# EAGLE design USB Isolator v001 (EAGLE 6.5.0)
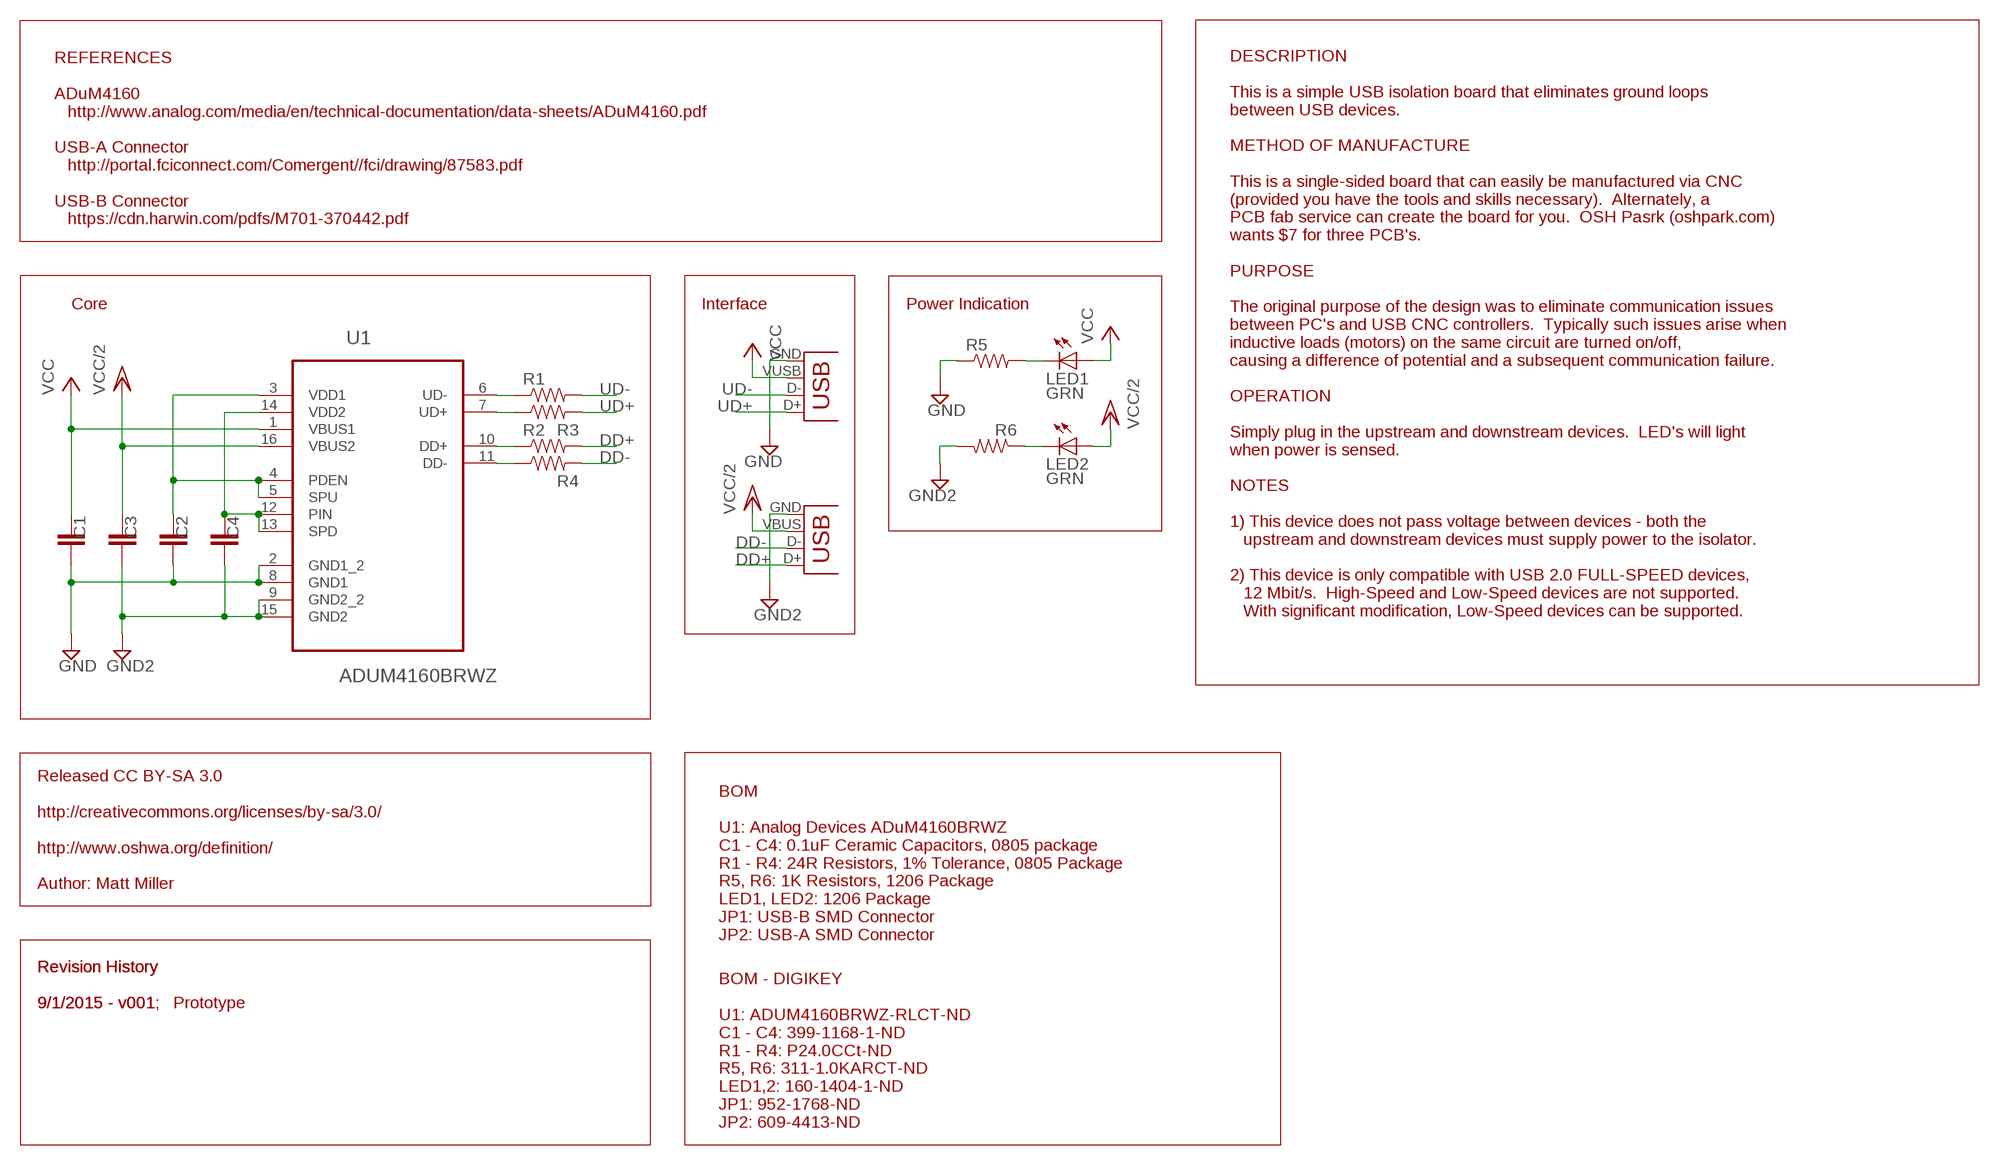
[diagram p0: schematic, sheet 1]

## Parts
C1  0.1uF  CAP0805  [0805]
C2  0.1uF  CAP0805  [0805]
C3  0.1uF  CAP0805  [0805]
C4  0.1uF  CAP0805  [0805]
JP1  USB-B-S  [USB-B-SMT]
JP2  USB-A-S  [USB-A-S]
LED1  GRN  LED1206  [LED-1206]
LED2  GRN  LED1206  [LED-1206]
R1  25  RESISTOR0805-RES  [0805]
R2  25  RESISTOR0805-RES  [0805]
R3  25  RESISTOR0805-RES  [0805]
R4  25  RESISTOR0805-RES  [0805]
R5  1K  RESISTOR1206  [1206]
R6  1K  RESISTOR1206  [1206]
U1  ADUM4160BRWZ  [SOIC127P1032X265-16N]

## Nets
DD+: JP2.D+ R4.2
DD-: JP2.D- R3.2
GND: C1.2 C2.2 JP1.GND R5.1 U1.2(GND1_2) U1.8(GND1)
GND2: C3.2 C4.2 JP2.GND R6.2 U1.9(GND2_2) U1.15(GND2)
N$1: LED1.C R5.2
N$3: C2.1 U1.3(VDD1) U1.4(PDEN) U1.5(SPU)
N$4: LED2.C R6.1
N$5: C4.1 U1.12(PIN) U1.13(SPD) U1.14(VDD2)
N$10: R1.1 U1.6(UD-)
N$11: R2.1 U1.7(UD+)
N$12: R4.1 U1.10(DD+)
N$13: R3.1 U1.11(DD-)
UD+: JP1.D+ R2.2
UD-: JP1.D- R1.2
VCC: C1.1 JP1.VUSB(VBUS) LED1.A U1.1(VBUS1)
VCC/2: C3.1 JP2.VBUS LED2.A U1.16(VBUS2)

## Notes on the sheet
- REFERENCES
  
  ADuM4160
     http://www.analog.com/media/en/technical-documentation/data-sheets/ADuM4160.pdf
  
  USB-A Connector
     http://portal.fciconnect.com/Comergent//fci/drawing/87583.pdf
  
  USB-B Connector
     https://cdn.harwin.com/pdfs/M701-370442.pdf
- Core | Interface | Power Indication
- DESCRIPTION
  
  This is a simple USB isolation board that eliminates ground loops
  between USB devices.  
  
  METHOD OF MANUFACTURE
  
  This is a single-sided board that can easily be manufactured via CNC 
  (provided you have the tools and skills necessary).  Alternately, a 
  PCB fab service can create the board for you.  OSH Pasrk (oshpark.com) 
  wants $7 for three PCB's.
  
  PURPOSE
  
  The original purpose of the design was to eliminate communication issues 
  between PC's and USB CNC controllers.  Typically such issues arise when 
  inductive loads (motors) on the same circuit are turned on/off, 
  causing a difference of potential and a subsequent communication failure.
  
  OPERATION
  
  Simply plug in the upstream and downstream devices.  LED's will light 
  when power is sensed.
  
  NOTES 
  
  1) This device does not pass voltage between devices - both the 
     upstream and downstream devices must supply power to the isolator.
  
  2) This device is only compatible with USB 2.0 FULL-SPEED devices, 
     12 Mbit/s.  High-Speed and Low-Speed devices are not supported.  
     With significant modification, Low-Speed devices can be supported.
- Released CC BY-SA 3.0
  
  http://creativecommons.org/licenses/by-sa/3.0/
  
  http://www.oshwa.org/definition/
  
  Author: Matt Miller
- BOM
  
  U1: Analog Devices ADuM4160BRWZ
  C1 - C4: 0.1uF Ceramic Capacitors, 0805 package
  R1 - R4: 24R Resistors, 1% Tolerance, 0805 Package
  R5, R6: 1K Resistors, 1206 Package
  LED1, LED2: 1206 Package
  JP1: USB-B SMD Connector
  JP2: USB-A SMD Connector
- Revision History
  
  9/1/2015 - v001;   Prototype
- Revision History
  
  9/1/2015 - v001
- BOM - DIGIKEY
  
  U1: ADUM4160BRWZ-RLCT-ND
  C1 - C4: 399-1168-1-ND
  R1 - R4: P24.0CCt-ND
  R5, R6: 311-1.0KARCT-ND
  LED1,2: 160-1404-1-ND
  JP1: 952-1768-ND
  JP2: 609-4413-ND

## Library data of the parts
C1-C4 = SparkFun-Passives:CAP: Capacitor Standard 0603 ceramic capacitor, and 0.1" leaded capacitor.
JP1 JP2 = SparkFun-Connectors:USB: USB Connectors USB-B-PTH is fully proven SKU : PRT-00139/CONN-08278 USB-miniB is fully proven SKU : PRT-00587 USB-A-PCB is untested. USB-A-H is throughly reviewed, but untested. Spark Fun Electronics SKU : PRT-00437 USB-B-SMT is throughly reviewed, but untested. Needs silkscreen touching up. USB-A-S has not been used/tested USB-MB-H has not been used/tested USB-MICROB has been used. CONN-09505
LED1 LED2 = SparkFun-LED:LED: LEDs Standard schematic elements and footprints for 5mm, 3mm, 1206, and 0603 sized LEDs. 5mm - Spark Fun Electronics SKU : COM-00529 (and others)
R1-R4 = SparkFun-Passives:RESISTOR: Resistor Basic schematic elements and footprints for 0603, 1206, and PTH resistors.
R5 R6 = SparkFun-Resistors:RESISTOR: Resistor Basic schematic elements and footprints for 0603, 1206, and PTH resistors.
U1 = Analog Devices_By_element14_Batch_1:ADUM4160BRWZ: Full/Low Speed 5 kV USB Digital Isolator; MPN: ADUM4160BRWZ; OC_FARNELL: 1858056; OC_NEWARK: 24R8652; PACKAGE: SOIC-16; SUPPLIER: Analog Devices

## Board
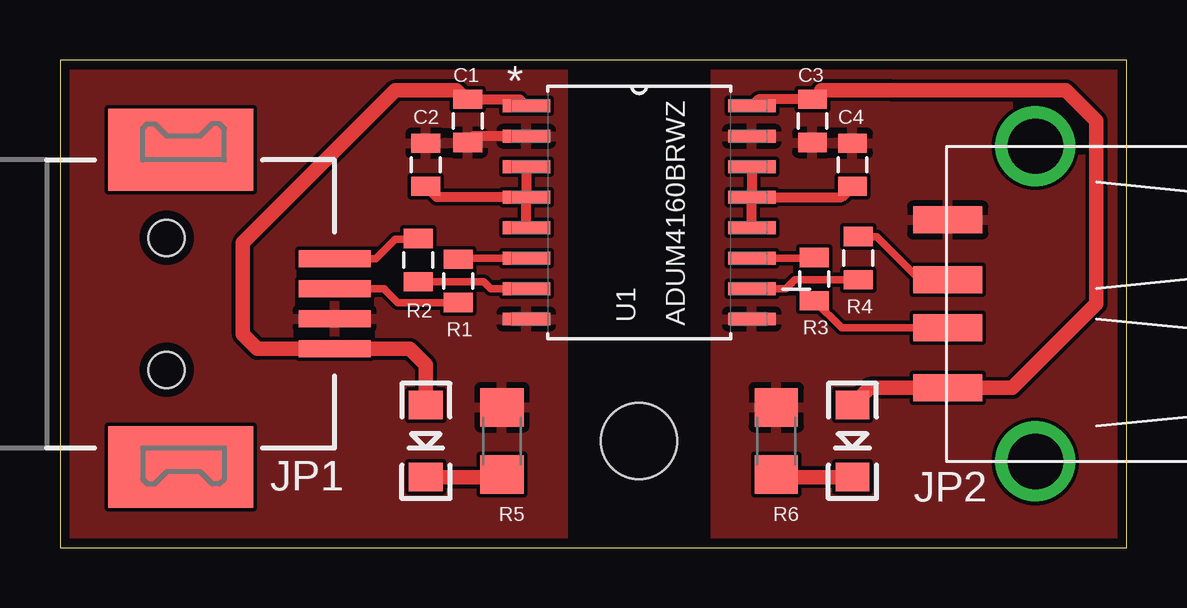
[diagram p1: board, top side]
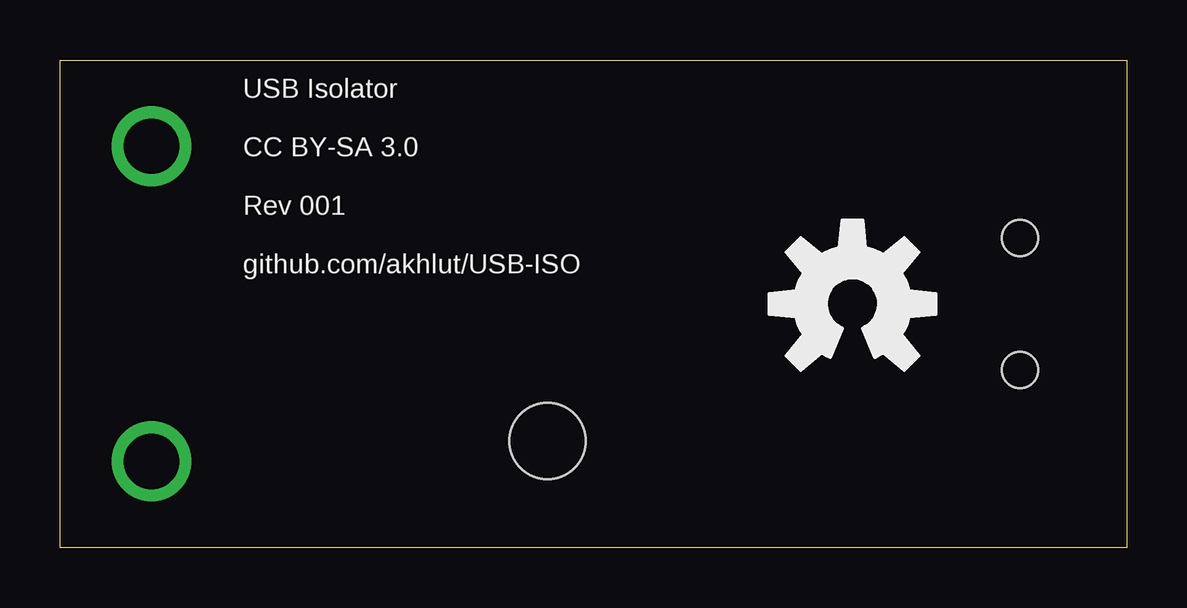
[diagram p2: board, bottom side, seen from below]

Size 44.45 x 20.32 mm. Coordinates in mm from the lower left corner, seen from the top.
Outline: 0,0 44.45,0 44.45,20.32 0,20.32 0,0
Copper layers (1*16): Top 0.0356mm / dielectric 1.5011mm / Bottom 0.0356mm
Design rules "LaenPCBOrder": minimum track width 6mil, minimum drill 13mil, track to track 6mil, track to pad 6mil, pad to pad 6mil, via to via 6mil, smd to smd 6mil, copper to edge 15mil, drill to drill 6mil, minimum pad ring 7mil, minimum via ring 7mil, stop-mask expansion 3mil, vias tented up to drill 0mil, thermal gap 10mil
Holes 3.17 mm at 24.13,4.45

### Footprints (pad centres in the part's own frame; a part is rotated, then mirrored left to right if it is on the bottom)
0805 = smd 0.8 x 1.2: 1 -0.9,0; 2 0.9,0
USB-B-SMT = smd 6.04 x 3.4: 5 0.58,6.42; 6 0.58,-6.8 | smd 3 x 0.7: D+ 7,1.875; D- 7,0.625; GND 7,-0.625; VUSB 7,-1.875 | hole 1.5: 0,2.75; 0,-2.75
USB-A-S = smd 2.88 x 1.12: D+ 3.65,-1; D- 3.65,1; GND 3.65,-3.5; VBUS 3.65,3.5 | drill 2.311: P$5 0,-6.566; P$6 0,6.566
LED-1206 = smd 1.2 x 1.4: A -1.5,0; C 1.5,0
1206 = smd 1.6 x 1.8: 1 -1.4,0; 2 1.4,0
SOIC127P1032X265-16N = smd 1.981 x 0.533: 1 -4.699,4.445; 2 -4.699,3.175; 3 -4.699,1.905; 4 -4.699,0.635; 5 -4.699,-0.635; 6 -4.699,-1.905; 7 -4.699,-3.175; 8 -4.699,-4.445; 9 4.699,-4.445; 10 4.699,-3.175; 11 4.699,-1.905; 12 4.699,-0.635; 13 4.699,0.635; 14 4.699,1.905; 15 4.699,3.175; 16 4.699,4.445

### Placement (x,y rotation side)
C1  16.99,17.78 270 top
C2  15.24,15.95 90 top
C3  31.35,17.78 270 top
C4  33.02,15.95 90 top
JP1  4.45,10.16 0 top
JP2  40.64,10.16 180 top
LED1  15.24,4.45 270 top
LED2  33.02,4.45 270 top
R1  16.59,11.11 270 top
R2  14.92,11.98 90 top
R3  31.43,11.19 270 top
R4  33.26,12.06 90 top
R5  18.41,4.45 270 top
R6  29.84,4.45 90 top
U1  24.13,13.97 0 top
U$1  [OSHW-LOGO-L]  11.43,10.16 0 bottom

### Tracks (layer width: path | path; a pad name or v marks a point on that pad's centre or on a via)
DD+
  Top 0.305: R4.2 34.02,12.96 34.29,12.7 35.83,11.16 JP2.D+
DD-
  Top 0.305: JP2.D- 32.56,9.16 R3.2
GND
  Top 0.406: U1.2 17.25,17.14 C1.2
  pour Top: -1.27,21.59 20.95,21.59 20.95,-1.27 -1.27,-1.27
GND2
  pour Top: 27.3,21.59 27.3,-1.27 45.72,-1.27 45.72,21.59
N$1
  Top 0.61: LED1.C 18.32,2.94 R5.2
N$3
  Top 0.406: U1.4 15.69,14.61 C2.1 | U1.5 U1.4 | U1.3 U1.4
N$4
  Top 0.61: LED2.C 29.95,2.94 R6.1
N$5
  Top 0.406: U1.13 32.57,14.61 C4.1 | U1.12 U1.13 | U1.14 U1.13
N$10
  Top 0.305: U1.6 16.64,12.06 R1.1
N$11
  Top 0.305: R2.1 17.65,11.08 17.94,10.79 U1.7
N$12
  Top 0.305: R4.1 30.61,11.16 30.24,10.79 U1.10
N$13
  Top 0.305: U1.11 31.41,12.06 R3.1
UD+
  Top 0.305: JP1.D+ 13.15,12.04 13.97,12.86 14.9,12.86 R2.2
UD-
  Top 0.305: JP1.D- 13.5,10.79 13.57,10.72 14.08,10.21 R1.2
VCC
  Top 0.305: C1.1 16.88,18.68 16.51,19.05
  Top 0.406: C1.1 19.17,18.68 U1.1
  Top 0.61: 16.88,18.68 16.51,19.05 13.97,19.05 12.7,17.78 7.62,12.7 7.62,8.89 8.22,8.29 JP1.VUSB 14.57,8.29 15.24,7.62 LED1.A
VCC/2
  Top 0.406: 31.75,19.05 31.38,18.68 C3.1 29.09,18.68 U1.16
  Top 0.61: 31.72,19.05 31.75,19.05 34.69,19.05 41.91,19.05 43.18,17.78 43.18,10.16 40.64,7.62 40.18,7.16 39.68,6.66 JP2.VBUS 33.73,6.66 LED2.A

### Text on the board
bNames: USB Isolator / / CC BY-SA 3.0 / / Rev 001 / / github.com/akhlut/USB-ISO